# EAGLE design V0.8 (EAGLE 9.1.1)

## Sheet 1 of 2
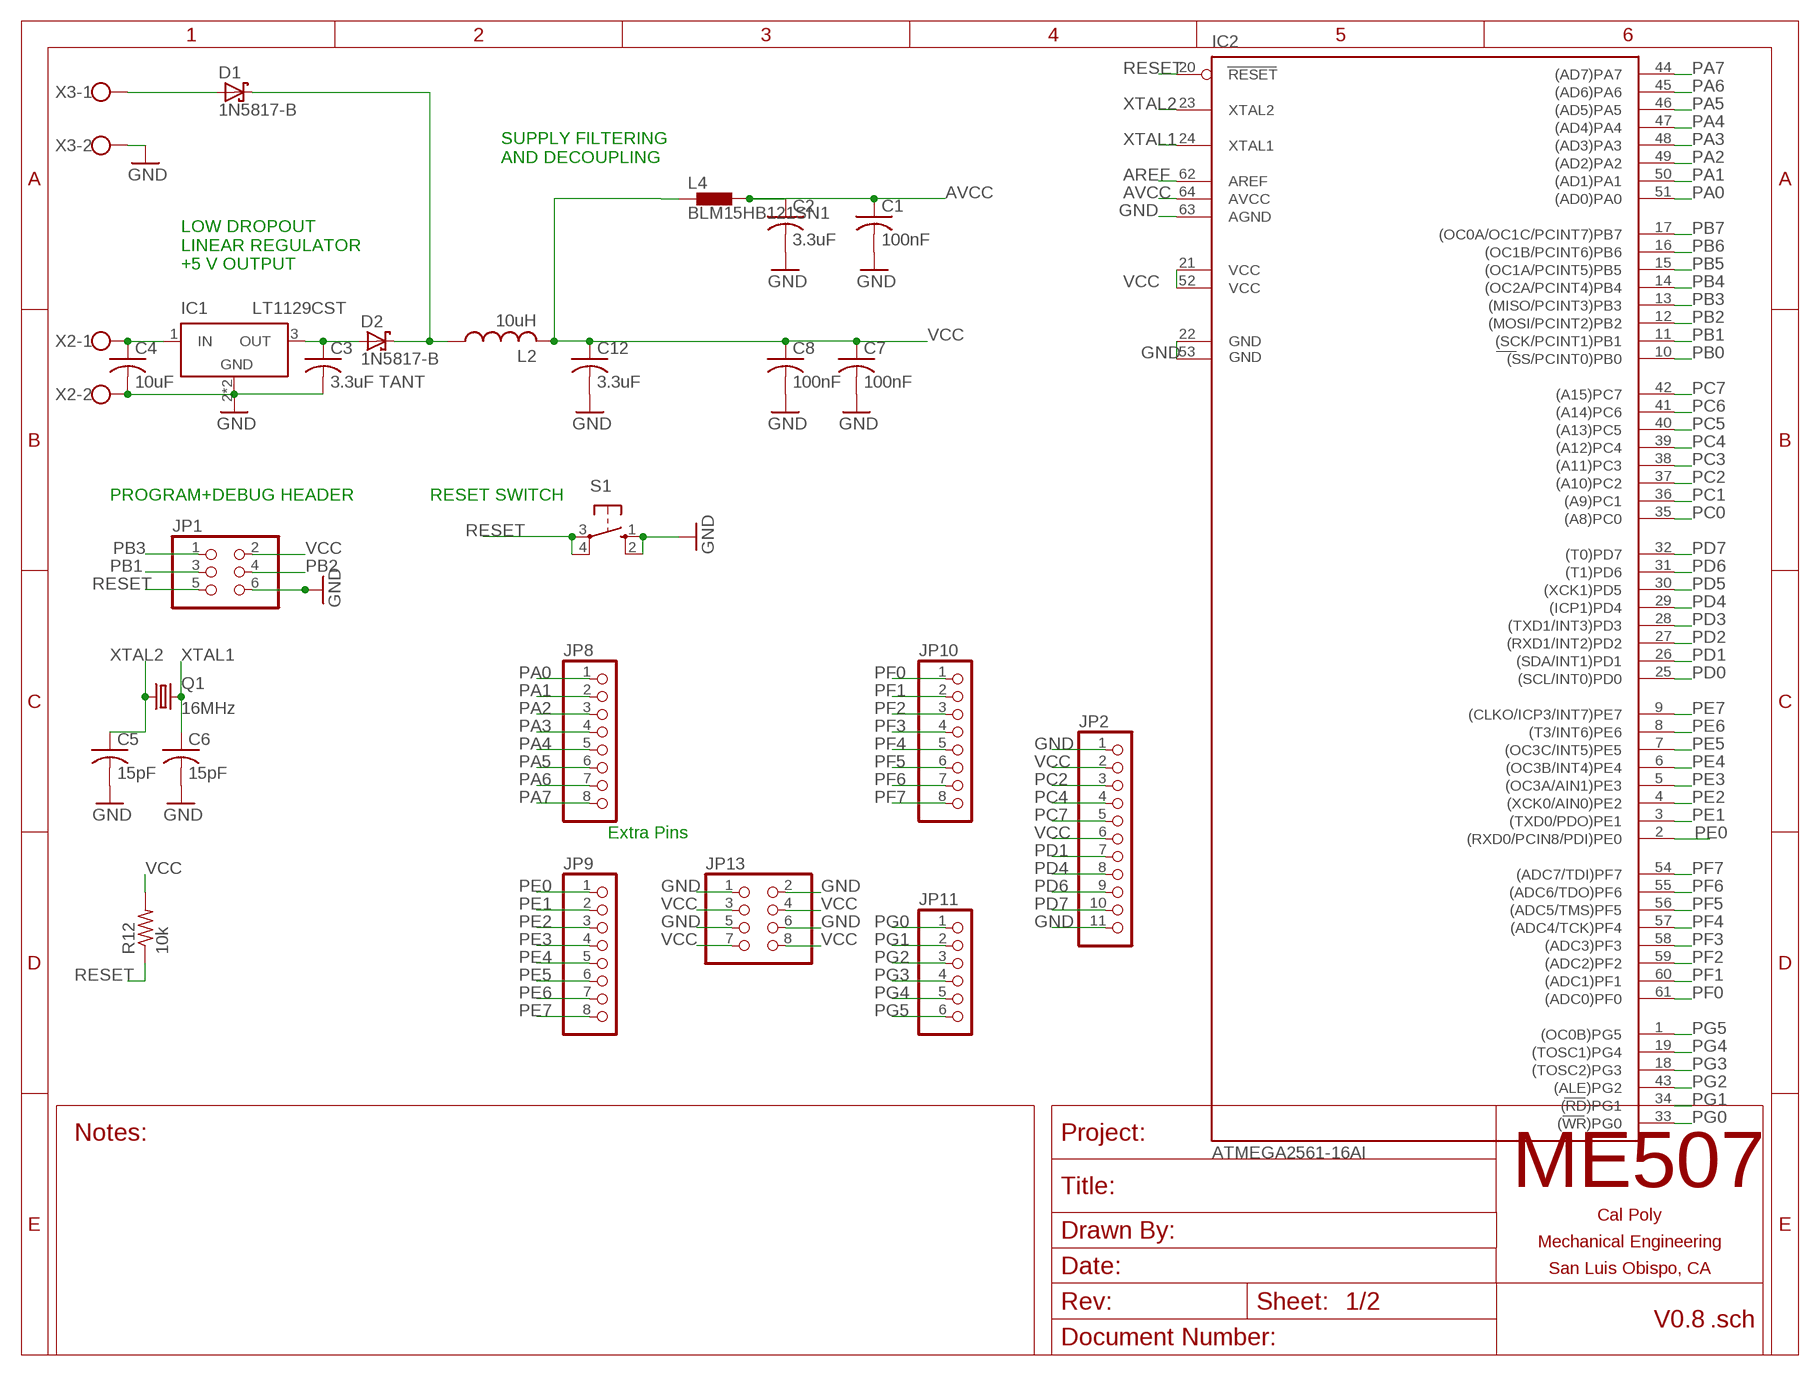
[diagram p0: schematic, sheet 1]

### Parts
C1  100nF  C-USC0805  [C0805]
C2  3.3uF  C-USC0805  [C0805]
C3  3.3uF TANT  C-USC0805  [C0805]
C4  10uF  C-USC0805  [C0805]
C5  15pF  C-USC0805  [C0805]
C6  15pF  C-USC0805  [C0805]
C7  100nF  C-USC0805  [C0805]
C8  100nF  C-USC0805  [C0805]
C12  3.3uF  C-USC0805  [C0805]
D1  1N5817-B  [DO41-7.6]
D2  1N5817-B  [DO41-7.6]
IC1  LT1129CST  [SOT223]
IC2  ATMEGA2561-16AI  [TQFP64]
JP1  PINHD-2X3  [2X03]
JP2  PINHD-1X11  [1X11]
JP8  PINHD-1X8  [1X08]
JP9  PINHD-1X8  [1X08]
JP10  PINHD-1X8  [1X08]
JP11  PINHD-1X6  [1X06]
JP13  PINHD-2X4  [2X04]
L2  10uH  L-USL1812  [L1812]
L4  BLM15HB121SN1  [0402]
Q1  16MHz  CRYSTALHC49S  [HC49/S]
R12  10k  R-US_R0805  [R0805]
S1  10-XX  [B3F-10XX]
X2  W237-102  [W237-102]
X3  W237-102  [W237-102]

### Nets
AREF: IC2.62(AREF)
AVCC: C1.1 C2.1 IC2.64(AVCC) L4.2
GND: C1.2 C2.2 C3.2 C4.2 C5.2 C6.2 C7.2 C8.2 C12.2 IC1.2(GND) IC1.4(GND) IC2.22(GND) IC2.53(GND1) IC2.63(AGND) JP1.6 JP2.1 JP2.11 JP13.1 JP13.2 JP13.5 JP13.6 S1.1(S) S1.2(S1) X2.2 X3.2 ; also sheet 2
N$12: D1.C D2.C L2.1
N$13: D1.A X3.1
PA0: IC2.51((AD0)PA0) JP8.1
PA1: IC2.50((AD1)PA1) JP8.2
PA2: IC2.49((AD2)PA2) JP8.3
PA3: IC2.48((AD3)PA3) JP8.4
PA4: IC2.47((AD4)PA4) JP8.5
PA5: IC2.46((AD5)PA5) JP8.6
PA6: IC2.45((AD6)PA6) JP8.7
PA7: IC2.44((AD7)PA7) JP8.8
PB0: IC2.10((SS/PCINT0)PB0)
PB1: IC2.11((SCK/PCINT1)PB1) JP1.3
PB2: IC2.12((MOSI/PCINT2)PB2) JP1.4
PB3: IC2.13((MISO/PCINT3)PB3) JP1.1
PB4: IC2.14((OC2A/PCINT4)PB4) ; also sheet 2
PB5: IC2.15((OC1A/PCINT5)PB5) ; also sheet 2
PB6: IC2.16((OC1B/PCINT6)PB6) ; also sheet 2
PB7: IC2.17((OC0A/OC1C/PCINT7)PB7) ; also sheet 2
PC0: IC2.35((A8)PC0) ; also sheet 2
PC1: IC2.36((A9)PC1) ; also sheet 2
PC2: IC2.37((A10)PC2) JP2.3 ; also sheet 2
PC3: IC2.38((A11)PC3) ; also sheet 2
PC4: IC2.39((A12)PC4) JP2.4 ; also sheet 2
PC5: IC2.40((A13)PC5) ; also sheet 2
PC6: IC2.41((A14)PC6) ; also sheet 2
PC7: IC2.42((A15)PC7) JP2.5
PD0: IC2.25((SCL/INT0)PD0)
PD1: IC2.26((SDA/INT1)PD1) JP2.7
PD2: IC2.27((RXD1/INT2)PD2) ; also sheet 2
PD3: IC2.28((TXD1/INT3)PD3) ; also sheet 2
PD4: IC2.29((ICP1)PD4) JP2.8
PD5: IC2.30((XCK1)PD5)
PD6: IC2.31((T1)PD6) JP2.9
PD7: IC2.32((T0)PD7) JP2.10
PE0: IC2.2((RXD0/PCIN8/PDI)PE0) JP9.1
PE1: IC2.3((TXD0/PDO)PE1) JP9.2
PE2: IC2.4((XCK0/AIN0)PE2) JP9.3
PE3: IC2.5((OC3A/AIN1)PE3) JP9.4
PE4: IC2.6((OC3B/INT4)PE4) JP9.5
PE5: IC2.7((OC3C/INT5)PE5) JP9.6
PE6: IC2.8((T3/INT6)PE6) JP9.7
PE7: IC2.9((CLKO/ICP3/INT7)PE7) JP9.8
PF0: IC2.61((ADC0)PF0) JP10.1
PF1: IC2.60((ADC1)PF1) JP10.2
PF2: IC2.59((ADC2)PF2) JP10.3
PF3: IC2.58((ADC3)PF3) JP10.4
PF4: IC2.57((ADC4/TCK)PF4) JP10.5
PF5: IC2.56((ADC5/TMS)PF5) JP10.6
PF6: IC2.55((ADC6/TDO)PF6) JP10.7
PF7: IC2.54((ADC7/TDI)PF7) JP10.8
PG0: IC2.33((WR)PG0) JP11.1
PG1: IC2.34((RD)PG1) JP11.2
PG2: IC2.43((ALE)PG2) JP11.3
PG3: IC2.18((TOSC2)PG3) JP11.4
PG4: IC2.19((TOSC1)PG4) JP11.5
PG5: IC2.1((OC0B)PG5) JP11.6
RESET: IC2.20(RESET) JP1.5 R12.1 S1.3(P) S1.4(P1)
VCC: C7.1 C8.1 C12.1 IC2.21(VCC) IC2.52(VCC1) JP1.2 JP2.2 JP2.6 JP13.3 JP13.4 JP13.7 JP13.8 L2.2 L4.1 R12.2 ; also sheet 2
VIN: C4.1 IC1.1(IN) X2.1
VOUT: C3.1 D2.A IC1.3(OUT)
XTAL1: C6.1 IC2.24(XTAL1) Q1.2
XTAL2: C5.1 IC2.23(XTAL2) Q1.1

### Notes on the sheet
- SUPPLY FILTERING 
  AND DECOUPLING
- LOW DROPOUT
  LINEAR REGULATOR
  +5 V OUTPUT
- PROGRAM+DEBUG HEADER | RESET SWITCH
- Extra Pins

## Sheet 2 of 2
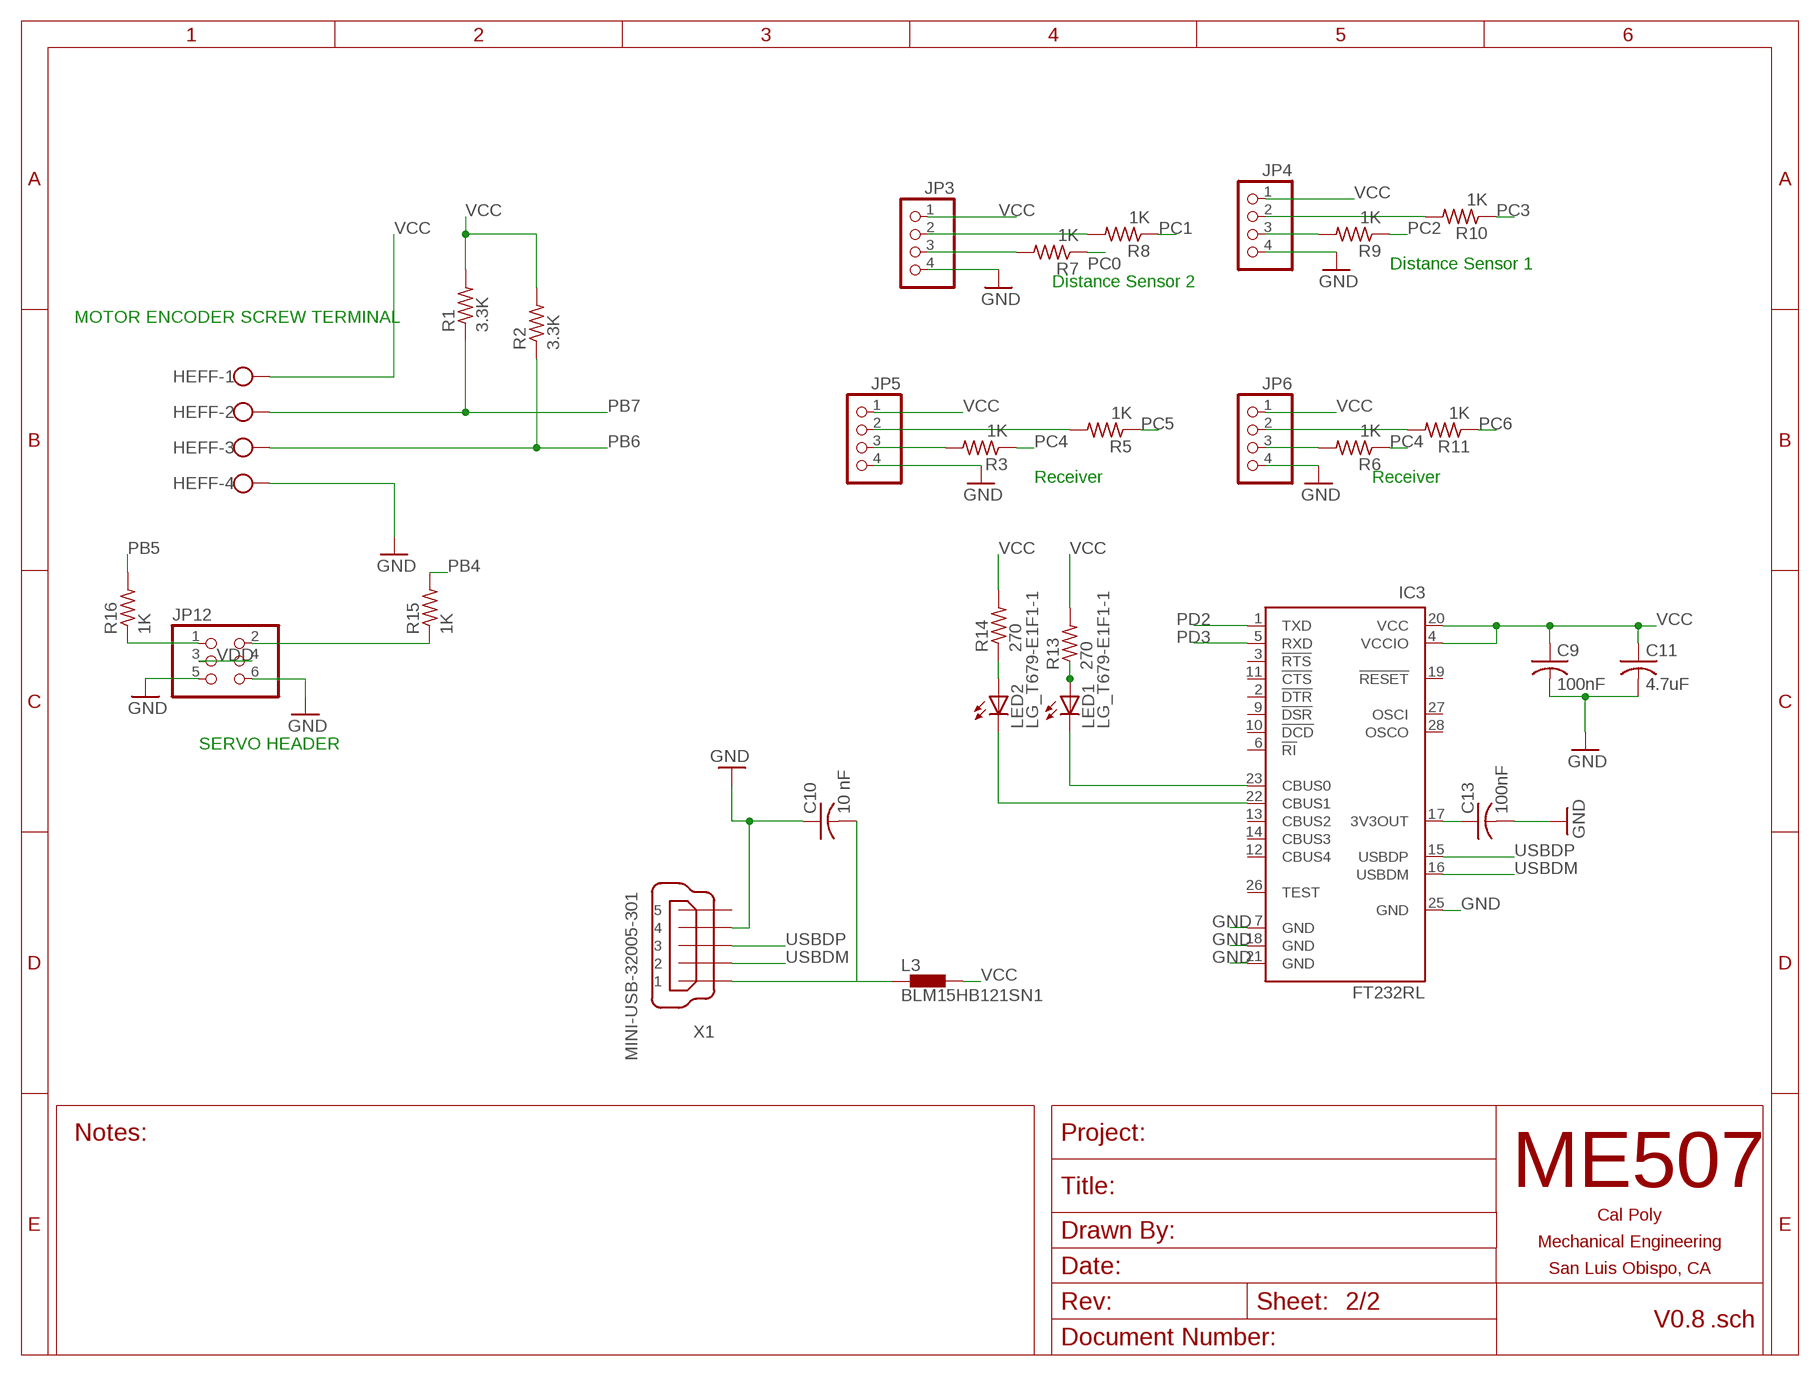
[diagram p1: schematic, sheet 2]

### Parts
C9  100nF  C-USC0805  [C0805]
C10  10 nF  C-USC0805  [C0805]
C11  4.7uF  C-USC0805  [C0805]
C13  100nF  C-USC0805  [C0805]
HEFF  W237-4  [W237-4]
IC3  FT232RL  [SSOP28]
JP3  PINHD-1X4  [1X04]
JP4  PINHD-1X4  [1X04]
JP5  PINHD-1X4  [1X04]
JP6  PINHD-1X4  [1X04]
JP12  PINHD-2X3  [2X03]
L3  BLM15HB121SN1  [0402]
LED1  LG_T679-E1F1-1  [PLCC2]
LED2  LG_T679-E1F1-1  [PLCC2]
R1  3.3K  R-US_R0805  [R0805]
R2  3.3K  R-US_R0805  [R0805]
R3  1K  R-US_R0805  [R0805]
R5  1K  R-US_R0805  [R0805]
R6  1K  R-US_R0805  [R0805]
R7  1K  R-US_R0805  [R0805]
R8  1K  R-US_R0805  [R0805]
R9  1K  R-US_R0805  [R0805]
R10  1K  R-US_R0805  [R0805]
R11  1K  R-US_R0805  [R0805]
R13  270  R-US_R0805  [R0805]
R14  270  R-US_R0805  [R0805]
R15  1K  R-US_R0805  [R0805]
R16  1K  R-US_R0805  [R0805]
X1  MINI-USB-32005-301  [32005-301]

### Nets
GND: C9.2 C10.1 C11.2 C13.2 HEFF.4 IC3.7(GND) IC3.18(GND) IC3.21(GND) IC3.25(GND) JP3.4 JP4.4 JP5.4 JP6.4 JP12.5 JP12.6 X1.4 ; also sheet 1
N$1: JP4.3 R9.2
N$2: JP5.3 R3.2
N$3: JP6.3 R6.2
N$4: JP5.2 R5.2
N$5: JP3.2 R8.2
N$6: JP3.3 R7.2
N$7: JP4.2 R10.2
N$9: JP6.2 R11.2
N$10: C10.2 L3.1 X1.1
N$11: C13.1 IC3.17(3V3OUT)
N$14: IC3.23(CBUS0) LED1.C
N$15: LED1.A R13.1
N$16: JP12.2 R15.1
N$17: IC3.22(CBUS1) LED2.C
N$18: LED2.A R14.1
N$19: JP12.1 R16.1
PB4: R15.2 ; also sheet 1
PB5: R16.2 ; also sheet 1
PB6: HEFF.3 R2.1 ; also sheet 1
PB7: HEFF.2 R1.1 ; also sheet 1
PC0: R7.1 ; also sheet 1
PC1: R8.1 ; also sheet 1
PC2: R9.1 ; also sheet 1
PC3: R10.1 ; also sheet 1
PC4: R3.1 R6.1 ; also sheet 1
PC5: R5.1 ; also sheet 1
PC6: R11.1 ; also sheet 1
PD2: IC3.1(TXD) ; also sheet 1
PD3: IC3.5(RXD) ; also sheet 1
USBDM: IC3.16(USBDM) X1.2
USBDP: IC3.15(USBDP) X1.3
VCC: C9.1 C11.1 HEFF.1 IC3.4(VCCIO) IC3.20(VCC) JP3.1 JP4.1 JP5.1 JP6.1 L3.2 R1.2 R2.2 R13.2 R14.2 ; also sheet 1
VDD: JP12.3 JP12.4
Unconnected: IC3.2(!DTR) IC3.3(!RTS) IC3.6(!RI) IC3.9(!DSR) IC3.10(!DCD) IC3.11(!CTS) IC3.12(CBUS4) IC3.13(CBUS2) IC3.14(CBUS3) IC3.19(!RESET) IC3.26(TEST) IC3.27(OSCI) IC3.28(OSCO) X1.5

### Notes on the sheet
- Distance Sensor 1
- Distance Sensor 2
- MOTOR ENCODER SCREW TERMINAL
- Receiver | Receiver
- SERVO HEADER

## Library data of the parts
C1-C13 = rcl:C-US: CAPACITOR, American symbol; SPICEPREFIX: C
D1 D2 = diode:1N581*: 1.0A SCHOTTKY BARRIER RECTIFIER Source: http://www.diodes.com/datasheets/ds23001.pdf
HEFF = con-wago-500:W237-4: WAGO SCREW CLAMP; OC_FARNELL: unknown; OC_NEWARK: unknown
IC1 = ME507:LT1129CST: VOLTAGE REGULATOR with shutdown; MPN: LT1129CST-5#PBF; OC_FARNELL: 1663375; OC_NEWARK: 57M2069
IC2 = atmel-2005:ATMEGA2561*: MICROCONTROLLER 256 Kbytes FLASH 4 Kbytes EEPROM 8 Kbytes SRAM 54 General Purpose I/O pins 6-channels 16-bit PWM 2 x Serial USARTs 8-channels 10-bit A/D
IC3 = ftdichip:FT232R: Source: http://www.ftdichip.com/Documents/DataSheets/DS_FT232R_v104.pdf; MPN: FT232RL; OC_FARNELL: 1146032; OC_NEWARK: 91K9918
JP1 JP12 = pinhead:PINHD-2X3: PIN HEADER
JP2 = pinhead:PINHD-1X11: PIN HEADER
JP3-JP6 = pinhead:PINHD-1X4: PIN HEADER
JP8-JP10 = pinhead:PINHD-1X8: PIN HEADER
JP11 = pinhead:PINHD-1X6: PIN HEADER
JP13 = pinhead:PINHD-2X4: PIN HEADER
L2 = rcl:L-US: INDUCTOR, American symbol; SPICEPREFIX: L
L3 L4 = inductors:BLM15H: EMIFIL (R) Chip Ferrite Bead for GHz Noise Source: http://www.murata.com/ Ferrite Bead BLM15H.pdf
LED1 LED2 = led:*_T679-?-1: LC TOPLED® Low Current LED Source: http://catalog.osram-os.com .. LG_LS_LY_T679_OBS.pdf; COLOR: green
Q1 = crystal:CRYSTAL: CRYSTAL; OC_FARNELL: 1667008; OC_NEWARK: unknown
R1-R3 R5-R16 = rcl:R-US_: RESISTOR, American symbol; SPICEPREFIX: R
S1 = switch-omron:10-XX: OMRON SWITCH; MPN: B3F-1000; OC_FARNELL: 176432; OC_NEWARK: 36M3542
X1 = con-cypressindustries:MINI-USB-: MINI USB-B Conector Source: www.cypressindustries.com; OC_FARNELL: unknown; OC_NEWARK: unknown
X2 X3 = con-wago-500:W237-102: WAGO SCREW CLAMP; MPN: 237-102; OC_FARNELL: unknown; OC_NEWARK: 70K9898

## Board
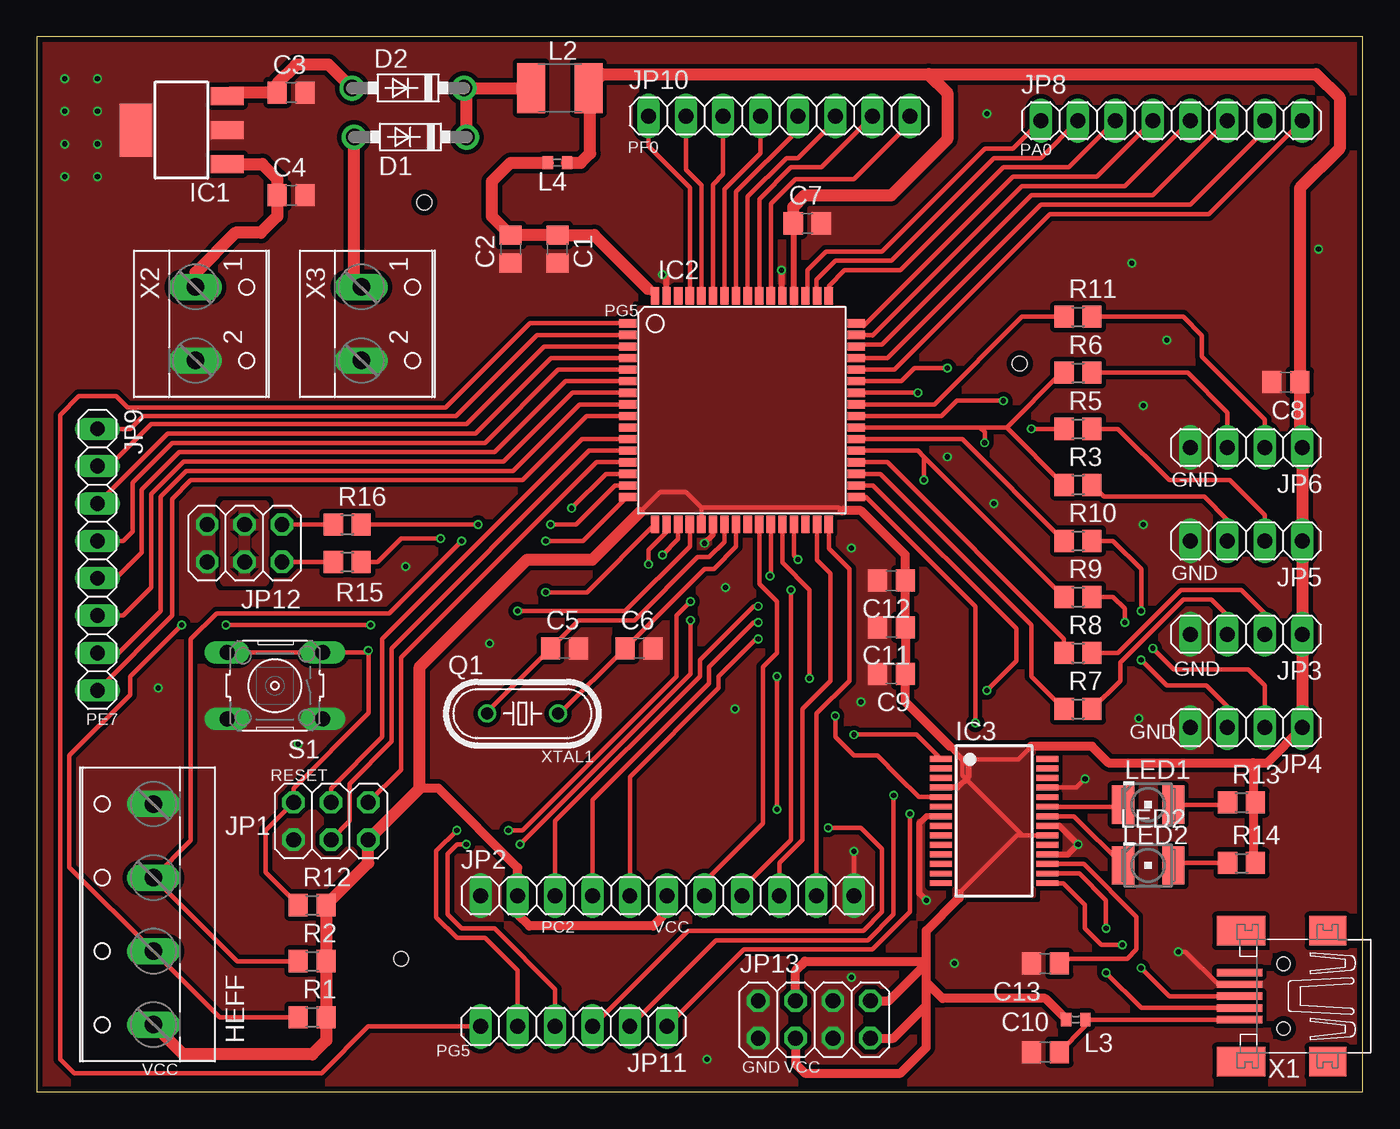
[diagram p2: board, top side]
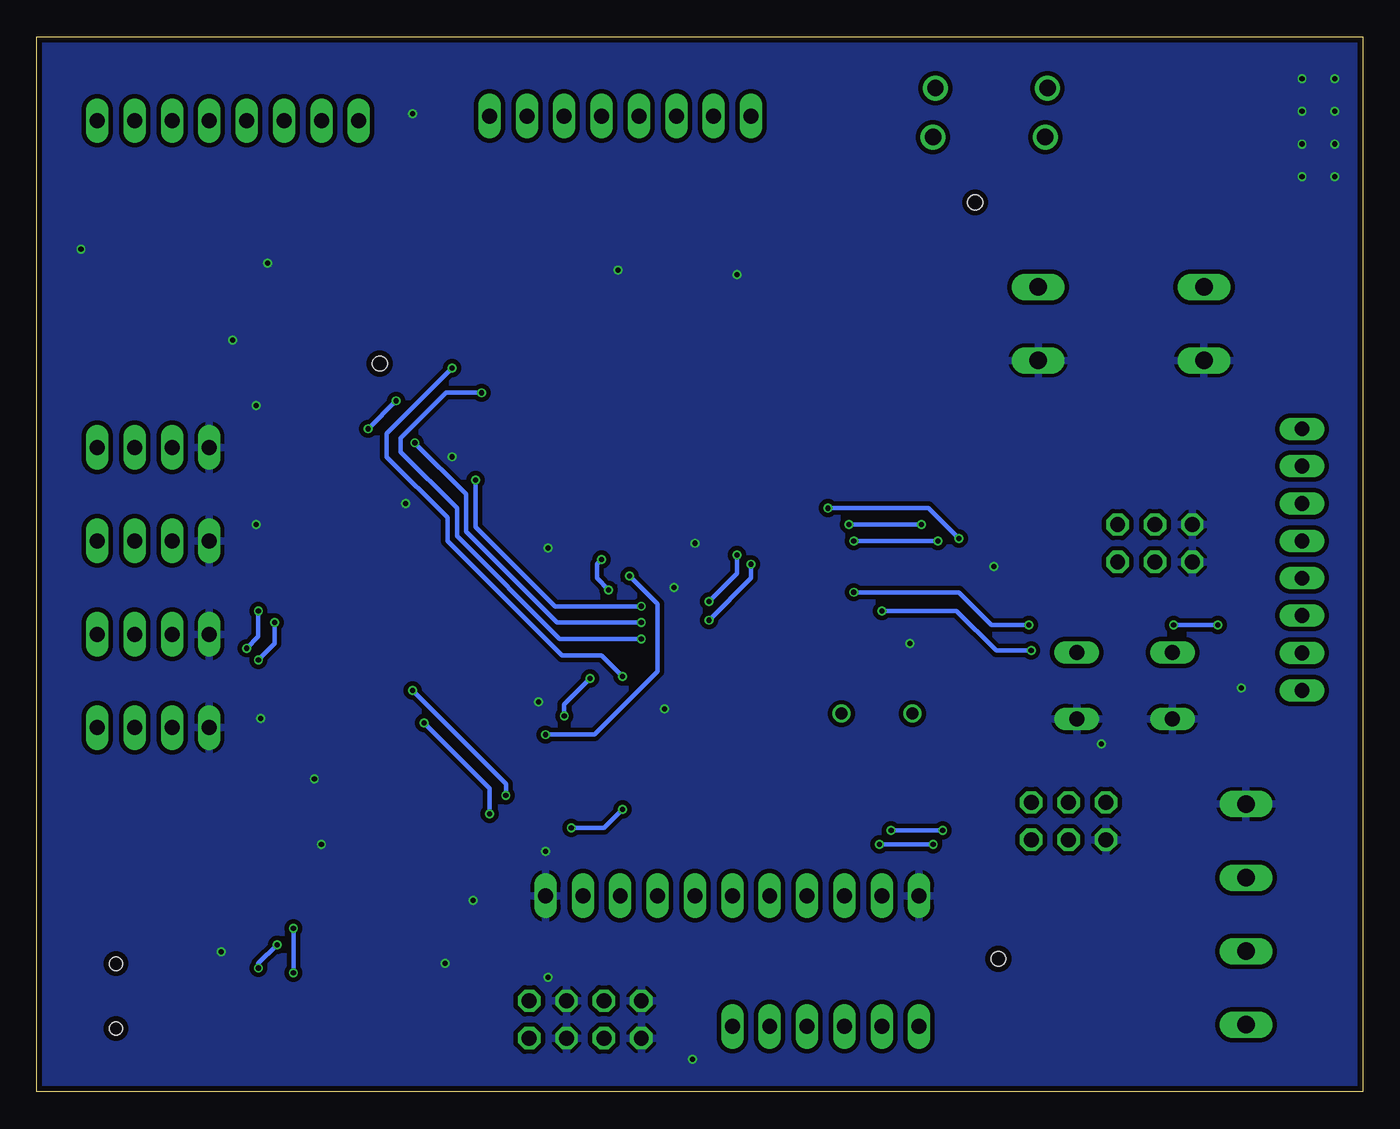
[diagram p3: board, bottom side, seen from below]

Size 90.16 x 71.75 mm. Coordinates in mm from the lower left corner, seen from the top.
Outline: 0,0 90.16,0 90.16,71.75 0,71.75 0,0
Copper layers (1*16): Top 0.035559375mm / dielectric 1.6mm / Bottom 0.035559375mm
Design rules "oshpark-2layer": minimum track width 6mil, minimum drill 10mil, track to track 6mil, track to pad 6mil, pad to pad 6mil, via to via 6mil, smd to smd 6mil, copper to edge 15mil, drill to drill 6mil, minimum pad ring 5mil, minimum via ring 5mil, stop-mask expansion 2.5mil, vias tented up to drill 0mil, thermal gap 10mil
Holes 1 mm at 24.77,9.05 66.83,49.53 26.35,60.48

### Footprints (pad centres in the part's own frame; a part is rotated, then mirrored left to right if it is on the bottom)
C0805 = smd 1.3 x 1.5: 1 -0.95,0; 2 0.95,0
DO41-7.6 = drill 1.1 pad 1.7: A 3.81,0; C -3.81,0
W237-4 = drill 1.194 long: 1 -7.5,-1.27; 2 -2.5,-1.27; 3 2.5,-1.27; 4 7.5,-1.27
SOT223 = smd 1.219 x 2.235: 1 -2.311,-3.099; 2 0,-3.099; 3 2.311,-3.099 | smd 3.6 x 2.2: 4 0,3.099
TQFP64 = smd 1.194 x 0.559: 1 -7.76,5.905; 2 -7.76,5.118; 3 -7.76,4.331; 4 -7.76,3.543; 5 -7.76,2.756; 6 -7.76,1.968; 7 -7.76,1.181; 8 -7.76,0.394; 9 -7.76,-0.394; 10 -7.76,-1.181; 11 -7.76,-1.968; 12 -7.76,-2.756; 13 -7.76,-3.543; 14 -7.76,-4.331; 15 -7.76,-5.118; 16 -7.76,-5.905; 33 7.76,-5.905; 34 7.76,-5.118; 35 7.76,-4.331; 36 7.76,-3.543; 37 7.76,-2.756; 38 7.76,-1.968; 39 7.76,-1.181; 40 7.76,-0.394; 41 7.76,0.394; 42 7.76,1.181; 43 7.76,1.968; 44 7.76,2.756; 45 7.76,3.543; 46 7.76,4.331; 47 7.76,5.118; 48 7.76,5.905 | smd 0.559 x 1.194: 17 -5.905,-7.76; 18 -5.118,-7.76; 19 -4.331,-7.76; 20 -3.543,-7.76; 21 -2.756,-7.76; 22 -1.968,-7.76; 23 -1.181,-7.76; 24 -0.394,-7.76; 25 0.394,-7.76; 26 1.181,-7.76; 27 1.968,-7.76; 28 2.756,-7.76; 29 3.543,-7.76; 30 4.331,-7.76; 31 5.118,-7.76; 32 5.905,-7.76; 49 5.905,7.76; 50 5.118,7.76; 51 4.331,7.76; 52 3.543,7.76; 53 2.756,7.76; 54 1.968,7.76; 55 1.181,7.76; 56 0.394,7.76; 57 -0.394,7.76; 58 -1.181,7.76; 59 -1.968,7.76; 60 -2.756,7.76; 61 -3.543,7.76; 62 -4.331,7.76; 63 -5.118,7.76; 64 -5.905,7.76
SSOP28 = smd 0.4 x 1.5: 1 -4.225,-3.625; 2 -3.575,-3.625; 3 -2.925,-3.625; 4 -2.275,-3.625; 5 -1.625,-3.625; 6 -0.975,-3.625; 7 -0.325,-3.625; 8 0.325,-3.625; 9 0.975,-3.625; 10 1.625,-3.625; 11 2.275,-3.625; 12 2.925,-3.625; 13 3.575,-3.625; 14 4.225,-3.625; 15 4.225,3.625; 16 3.575,3.625; 17 2.925,3.625; 18 2.275,3.625; 19 1.625,3.625; 20 0.975,3.625; 21 0.325,3.625; 22 -0.325,3.625; 23 -0.975,3.625; 24 -1.625,3.625; 25 -2.275,3.625; 26 -2.925,3.625; 27 -3.575,3.625; 28 -4.225,3.625
2X03 = drill 1.016 octagon: 1 -2.54,-1.27; 2 -2.54,1.27; 3 0,-1.27; 4 0,1.27; 5 2.54,-1.27; 6 2.54,1.27
1X11 = drill 1.016 long: 1 -12.7,0; 2 -10.16,0; 3 -7.62,0; 4 -5.08,0; 5 -2.54,0; 6 0,0; 7 2.54,0; 8 5.08,0; 9 7.62,0; 10 10.16,0; 11 12.7,0
1X04 = drill 1.016 long: 1 -3.81,0; 2 -1.27,0; 3 1.27,0; 4 3.81,0
1X08 = drill 1.016 long: 1 -8.89,0; 2 -6.35,0; 3 -3.81,0; 4 -1.27,0; 5 1.27,0; 6 3.81,0; 7 6.35,0; 8 8.89,0
1X06 = drill 1.016 long: 1 -6.35,0; 2 -3.81,0; 3 -1.27,0; 4 1.27,0; 5 3.81,0; 6 6.35,0
2X04 = drill 1.016 octagon: 1 -3.81,-1.27; 2 -3.81,1.27; 3 -1.27,-1.27; 4 -1.27,1.27; 5 1.27,-1.27; 6 1.27,1.27; 7 3.81,-1.27; 8 3.81,1.27
L1812 = smd 1.9 x 3.4: 1 -1.95,0; 2 1.95,0
0402 = smd 0.7 x 0.9: 1 -0.65,0; 2 0.65,0
PLCC2 = smd 2.6 x 1.5: A 0,1.7; C 0,-1.7
HC49/S = drill 0.813: 1 -2.413,0; 2 2.413,0
R0805 = smd 1.3 x 1.5: 1 -0.95,0; 2 0.95,0
B3F-10XX = drill 1.016 long: 1 -3.251,2.261; 2 3.251,2.261; 3 -3.251,-2.261; 4 3.251,-2.261
32005-301 = smd 3.1 x 0.5: 1 3,1.6; 2 3,0.8; 3 3,0; 4 3,-0.8; 5 3,-1.6 | smd 2.5 x 2: M1 -3,-4.45; M2 -3,4.45 | smd 3.3 x 2: M3 2.9,4.45; M4 2.9,-4.45 | hole 0.9: 0,2.2; 0,-2.2
W237-102 = drill 1.194 long: 1 -2.5,-1.27; 2 2.5,-1.27

### Placement (x,y rotation side)
C1  35.4,57.31 270 top
C2  32.23,57.31 270 top
C3  17.3,67.95 0 top
C4  17.3,60.96 0 top
C5  35.88,30.16 0 top
C6  40.96,30.16 0 top
C7  52.39,59.05 0 top
C8  84.93,48.26 180 top
C9  58.1,28.42 180 top
C10  68.58,2.7 0 top
C11  58.1,31.59 180 top
C12  58.1,34.77 180 top
C13  68.58,8.73 180 top
D1  25.4,64.93 180 top
D2  25.24,68.26 180 top
HEFF  6.67,12.06 90 top
IC1  9.84,65.41 90 top
IC2  47.94,46.35 0 top
IC3  65.09,18.41 270 top
JP1  20,18.41 180 top
JP2  42.86,13.33 0 top
JP3  82.23,31.11 180 top
JP4  82.23,24.77 180 top
JP5  82.23,37.46 180 top
JP6  82.23,43.81 180 top
JP8  77.15,66.04 0 top
JP9  4.13,36.2 270 top
JP10  50.48,66.36 0 top
JP11  36.51,4.44 180 top
JP12  14.13,37.31 180 top
JP13  52.86,4.92 0 top
L2  35.56,68.26 0 top
L3  70.64,4.92 180 top
L4  35.4,63.18 180 top
LED1  75.56,19.53 270 top
LED2  75.56,15.4 270 top
Q1  33.02,25.72 0 top
R1  18.73,5.08 0 top
R2  18.73,8.89 0 top
R3  70.8,41.27 0 top
R5  70.8,45.09 0 top
R6  70.8,48.89 0 top
R7  70.8,26.03 0 top
R8  70.8,29.84 0 top
R9  70.8,33.65 0 top
R10  70.8,37.46 0 top
R11  70.8,52.7 0 top
R12  18.73,12.7 0 top
R13  81.92,19.69 0 top
R14  81.92,15.56 0 top
R15  21.11,36.04 0 top
R16  21.11,38.58 0 top
S1  16.19,27.62 180 top
X1  84.77,6.51 180 top
X2  12.06,52.23 270 top
X3  23.34,52.23 270 top

### Tracks (layer width: path | path; a pad name or v marks a point on that pad's centre or on a via)
AVCC
  Top 0.406: IC2.64 41.54,54.61
  Top 0.813: 41.54,54.61 37.89,58.26 C1.1 C2.1 30.96,59.53 30.96,61.91 32.23,63.18 L4.2
GND  (via drill 0.35)
  Top 0.305: JP2.11 v55.56,16.35 | X1.4 80.32,7.31 78.1,9.53 v77.63,9.53 | IC3.25 70.7,20.69 v71.28,21.27
  Top 0.406: v45.4,37.31 45.97,37.88 IC2.22 | v50.64,55.88 50.64,54.17 IC2.53 | IC2.63 42.82,55.28 v42.54,55.56 | IC3.18 70.12,16.14 v70.8,16.83 69.54,18.09 IC3.21 | IC3.7 60.49,18.74 60.01,18.26 60.01,13.49 v60.48,13.02
  other vias: 61.91,43.18 65.09,40 30.8,30.48 25.08,35.72 4.13,68.9 1.91,68.9 1.91,66.68 4.13,66.68 1.91,64.45 4.13,64.45 4.13,62.23 1.91,62.23 46.83,34.29 47.47,26.03 55.4,36.99 76.84,51.12 74.45,56.36 87.15,57.31 8.25,27.46 17.78,23.65 64.61,66.52 62.39,8.73 56.04,26.51 45.56,2.22 55.4,7.78 75.25,46.67 75.25,38.58 74.93,25.4
  pour Top (isolate 0.305, rank 4, no thermals): 0.32,0 0.32,71.76 90.17,71.76 90.17,0.32 0.64,0.32
  pour Bottom (isolate 0.305): 0.16,0 0.16,71.76 89.85,71.76 90.17,71.44 90.17,0.48 90.01,0.32 0.48,0.32
N$1  (via drill 0.35)
  Top 0.305: JP4.3 80.96,26.19 79.53,27.62 76.84,27.62 v75.09,29.37 | v73.98,31.91 73.98,32.86 73.18,33.65 R9.2
  Bottom 0.305: v75.09,29.37 73.98,30.48 v73.98,31.91
N$2
  Top 0.305: JP5.3 80.96,38.89 79.37,40.48 72.55,40.48 R3.2
N$3
  Top 0.305: JP6.3 80.96,46.2 78.26,48.89 R6.2
N$4
  Top 0.305: JP5.2 83.5,39.21 81.12,41.59 76.99,41.59 73.5,45.09 R5.2
N$5
  Top 0.305: JP3.2 83.5,32.54 81.92,34.13 77.79,34.13 73.5,29.84 R8.2
N$6
  Top 0.305: R7.2 73.66,27.94 73.66,29.21 77.95,33.5 79.85,33.5 80.96,32.38 JP3.3
N$7  (via drill 0.35)
  Top 0.305: R10.2 73.18,37.46 75.09,35.56 v75.09,32.7 | v75.88,30.16 77.31,28.73 82.39,28.73 83.5,27.62 JP4.2
  Bottom 0.305: v75.09,32.7 75.09,30.96 v75.88,30.16
N$9
  Top 0.305: JP6.2 83.5,45.72 79.22,50.01 79.22,51.43 77.95,52.7 R11.2
N$10
  Top 0.305: X1.1 71.31,4.91 | 71.31,4.91 L3.1 | C10.2 71.31,4.47 71.31,4.91
N$11
  Top 0.305: IC3.17 71.19,15.49 74.77,11.91 74.77,9.68 74.14,9.05 69.85,9.05
  Top 0.61: 69.85,9.05 C13.1
N$12
  Top 0.813: L2.1 D2.C 29.21,68.1 D1.C
N$13
  Top 0.813: X3.1 21.59,55.2 D1.A
N$14
  Top 0.305: IC3.23 73.73,19.39 LED1.C
N$15
  Top 0.152: 80.81,19.53 R13.1
  Top 0.305: LED1.A 80.81,19.53
N$16
  Top 0.305: JP12.2 R15.1
N$17
  Top 0.305: LED2.C 70.52,18.74 IC3.22
N$18
  Top 0.305: LED2.A 77.42,15.56 R14.1
N$19
  Top 0.305: JP12.1 R16.1
PA0
  Top 0.305: IC2.51 52.39,54.23 52.39,55.88 53.66,57.15 57.47,57.15 64.45,64.14 66.36,64.14 JP8.1
PA1
  Top 0.305: IC2.50 53.02,54.15 53.02,55.23 54.3,56.51 58.1,56.51 65.09,63.5 68.26,63.5 JP8.2
PA2
  Top 0.305: JP8.3 70.17,62.87 65.72,62.87 58.74,55.88 54.93,55.88 53.85,54.8 IC2.49
PA3
  Top 0.305: IC2.48 56.01,52.26 56.2,52.07 66.36,62.23 72.07,62.23 JP8.4
PA4
  Top 0.305: IC2.47 56.79,51.47 56.83,51.43 66.99,61.59 73.98,61.59 JP8.5
PA5
  Top 0.305: IC2.46 55.82,50.8 57.47,50.8 67.63,60.96 75.88,60.96 JP8.6
PA6
  Top 0.305: IC2.45 57.84,49.9 68.26,60.32 78.42,60.32 83.5,65.41 JP8.7
PA7
  Top 0.305: IC2.44 58.32,49.11 68.9,59.69 79.69,59.69 JP8.8
PB1
  Top 0.305: JP1.3 20,20.64 23.49,24.13 23.49,30.8 37.08,44.39 IC2.11
PB2
  Top 0.305: JP1.4 21.27,18.41 21.27,20.95 24.13,23.81 24.13,30.16 37.57,43.6 IC2.12
PB3
  Top 0.305: JP1.1 24.76,21.91 24.76,29.53 25.56,30.32 38.05,42.81 IC2.13
PB4  (via drill 0.35)
  Top 0.305: R15.2 23.18,36.04 24.76,37.62 v27.46,37.62 | IC2.14 38.69,42.02 v36.35,39.69
  Bottom 0.305: v27.46,37.62 29.53,39.69 v36.35,39.69
PB5  (via drill 0.35)
  Top 0.305: IC2.15 39.33,41.24 36.67,38.58 v34.92,38.58 | R16.2 v30,38.58
  Bottom 0.305: v30,38.58 v34.92,38.58
PB6  (via drill 0.35)
  Top 0.305: R2.1 13.61,8.89 HEFF.3 10.48,17.1 10.48,30.8 12.22,32.54 23.97,32.54 v28.89,37.46 | v34.61,37.46 37.15,37.46 40.13,40.45 IC2.16
  Bottom 0.305: v28.89,37.46 v34.61,37.46
PB7  (via drill 0.35)
  Top 0.305: R1.1 12.42,5.08 HEFF.2 2.22,15.28 2.22,22.86 6.35,26.99 6.35,28.26 v9.84,31.75 | IC2.17 37.41,33.97 v34.61,33.97 | v12.86,31.75 v22.7,31.75
  Bottom 0.305: v34.61,33.97 27.46,33.97 25.24,31.75 v22.7,31.75 | v9.84,31.75 v12.86,31.75
PC0
  Top 0.305: R7.1 67.63,28.26 67.63,31.75 57.35,42.02 IC2.35
PC1
  Top 0.305: IC2.36 57.84,42.81 69.85,30.79 R8.1
PC2  (via drill 0.35)
  Top 0.305: IC2.37 59.91,43.6 60.33,43.18 | 60.33,43.18 R9.1 | 60.33,43.18 v60.33,41.59 | JP2.3 35.24,18.1 35.24,18.41 45.09,28.26 45.09,29.37 48.74,33.02 v49.05,33.02
  Bottom 0.305: v60.33,41.59 60.33,38.42 54.93,33.02 v49.05,33.02
PC3
  Top 0.305: IC2.38 62.93,44.39 R10.1
PC4  (via drill 0.35)
  Top 0.305: IC2.39 64.14,45.17 | 64.14,45.17 65.95,45.17 | 65.95,45.17 R3.1 | 65.95,45.17 69.67,48.89 R6.1 | 64.14,45.17 64.45,44.86 v64.45,44.13 | v49.05,31.91 48.74,31.91 45.72,28.89 45.72,27.78 37.78,19.84 JP2.4
  Bottom 0.305: v64.45,44.13 60.96,40.64 60.96,38.1 54.77,31.91 v49.05,31.91
PC5  (via drill 0.35)
  Top 0.305: IC2.40 61.52,45.96 62.55,46.99 v65.72,46.99 | v67.63,45.09 R5.1
  Bottom 0.305: v65.72,46.99 v67.63,45.09
PC6
  Top 0.305: IC2.41 61.04,46.75 66.99,52.7 R11.1
PC7  (via drill 0.35)
  Top 0.305: IC2.42 v59.92,47.54 | v49.05,30.8 48.89,30.8 46.35,28.26 46.35,27.46 40.32,21.43 JP2.5
  Bottom 0.305: v59.92,47.54 62.32,47.54 65.4,44.45 65.4,43.5 61.6,39.69 61.6,37.78 54.61,30.8 v49.05,30.8
PD1
  Top 0.305: JP2.7 45.4,14.29 49.37,18.26 49.37,28.89 50.32,29.84 50.32,33.34 49.12,34.54 49.12,36.44 49.12,36.67 IC2.26
PD2  (via drill 0.35)
  Top 0.305: IC2.27 49.91,35.15 v49.85,35.08 | IC3.1 59.81,24.29 v55.56,24.29
  Bottom 0.305: v49.85,35.08 47.94,33.18 47.94,28.57 52.23,24.29 v55.56,24.29
PD3  (via drill 0.35)
  Top 0.305: IC2.28 50.7,35.98 52.55,34.13 v52.55,28.1 | IC3.5 59.97,20.04 58.58,21.43 57.15,22.86 55.56,22.86 54.29,24.13 v54.29,25.56
  Bottom 0.305: v54.29,25.56 54.29,26.35 v52.55,28.1
PD4  (via drill 0.35)
  Top 0.305: JP2.8 47.94,13.81 51.28,17.14 v51.28,34.13 | IC2.29 51.49,36.46 v51.75,36.2
  Bottom 0.305: v51.75,36.2 52.07,35.88 52.07,34.92 v51.28,34.13
PD6
  Top 0.305: IC2.31 53.06,36.16 53.97,35.24 53.97,27.94 52.07,26.03 52.07,17.14 50.48,15.56 JP2.9
PD7
  Top 0.305: IC2.32 53.85,36.96 55.24,35.56 55.24,27.94 53.02,25.72 JP2.10
PE0
  Top 0.305: IC2.2 34.01,51.47 28.5,45.96 7.22,45.96 6.35,45.09 JP9.1
PE1
  Top 0.305: JP9.2 4.92,42.54 7.78,45.4 29.21,45.4 34.49,50.69 IC2.3
PE2
  Top 0.305: JP9.3 8.89,44.77 29.85,44.77 34.98,49.9 IC2.4
PE3
  Top 0.305: IC2.5 35.46,49.11 30.48,44.13 9.21,44.13 6.51,41.43 6.51,38.1 5.87,37.46 JP9.4
PE4
  Top 0.305: IC2.6 35.94,48.32 31.12,43.5 9.68,43.5 7.14,40.96 7.14,36.67 5.4,34.92 JP9.5
PE5
  Top 0.305: IC2.7 36.42,47.54 31.75,42.86 10,42.86 7.78,40.64 7.78,34.29 5.87,32.38 JP9.6
PE6
  Top 0.305: IC2.8 36.91,46.75 32.39,42.23 10.16,42.23 8.41,40.48 8.41,32.7 5.56,29.84 JP9.7
PE7
  Top 0.305: IC2.9 37.39,45.96 33.02,41.59 10.48,41.59 9.21,40.32 9.21,32.38 JP9.8
PF0
  Top 0.305: IC2.61 44.4,61.49 41.59,64.29 JP10.1
PF1
  Top 0.305: IC2.60 45.19,61.65 44.13,62.71 JP10.2
PF2
  Top 0.305: IC2.59 45.97,61.69 46.67,62.39 JP10.3
PF3
  Top 0.305: IC2.58 46.76,61.37 49.21,63.82 JP10.4
PF4
  Top 0.305: IC2.57 47.55,61.2 51.75,65.41 JP10.5
PF5
  Top 0.305: IC2.56 48.34,60.88 50.96,63.5 51.75,63.5 54.29,66.04 JP10.6
PF6
  Top 0.305: IC2.55 49.12,60.71 51.28,62.87 53.34,62.87 JP10.7
PF7
  Top 0.305: IC2.54 49.91,60.39 51.59,62.07 55.56,62.07 59.37,65.88 JP10.8
PG0  (via drill 0.35)
  Top 0.305: IC2.33 56.39,40.45 63.82,33.02 v63.82,25.08 | v59.37,18.89 59.37,14.13 59.37,12.22 57.78,10.64 56.83,9.68 48.1,9.68 JP11.1
  Bottom 0.305: v59.37,18.89 59.37,20.64 61.36,22.62 v63.82,25.08
PG1  (via drill 0.35)
  Top 0.305: IC2.34 56.87,41.24 66.6,31.51 66.6,29.29 v64.61,27.3 | JP11.2 46.2,10.32 56.52,10.32 58.26,12.06 58.26,14.45 v58.26,20.16
  Bottom 0.305: v58.26,20.16 58.26,20.95 v64.61,27.3
PG2  (via drill 0.35)
  Top 0.305: IC2.43 58.8,48.32 59.69,49.21 v61.91,49.21 | JP11.3 44.29,10.95 56.2,10.95 57.47,12.22 57.47,16.51 56.04,17.94 v53.82,17.94 | v50.32,28.26 v50.32,19.21
  Bottom 0.305: v61.91,49.21 66.36,44.77 66.36,43.18 62.23,39.05 62.23,37.46 54.45,29.69 51.75,29.69 v50.32,28.26 | v50.32,19.21 51.59,17.94 v53.82,17.94
PG3  (via drill 0.35)
  Top 0.305: JP11.4 35.24,6.98 31.12,11.11 28.89,11.11 27.94,12.06 27.94,16.19 28.57,16.83 v29.21,16.83 | IC2.18 42.82,38.06 41.59,36.83 v41.59,35.88 | v32.86,16.83 44.45,28.42 v44.45,32.07
  Bottom 0.305: v41.59,35.88 41.59,34.92 v44.45,32.07 | v29.21,16.83 v32.86,16.83
PG4  (via drill 0.35)
  Top 0.305: v44.45,33.34 43.5,32.38 43.5,28.26 33.02,17.78 v32.07,17.78 | v28.56,17.78 27.17,16.38 27.17,11.88 28.56,10.48 30.48,10.48 32.7,8.26 JP11.5 | IC2.19 43.61,37.58 v42.54,36.51
  Bottom 0.305: v42.54,36.51 42.54,35.24 v44.45,33.34 | v28.56,17.78 v32.07,17.78
PG5
  Top 0.305: JP11.6 22.54,4.44 19.37,1.27 2.54,1.27 1.59,2.22 1.59,46.04 2.86,47.31 5.4,47.31 6.19,46.51 27.78,46.51 33.53,52.26 IC2.1
RESET  (via drill 0.35)
  Top 0.305: R12.1 15.56,14.92 15.56,17.78 JP1.5 17.46,20.64 22.58,25.76 22.58,29.97 v22.54,30 22.42,29.88 S1.3 S1.4 | IC2.20 44.4,37.1 40,32.7 v32.7,32.7
  Bottom 0.305: v32.7,32.7 27.62,32.7 24.92,30 v22.54,30
USBDM  (via drill 0.35)
  Top 0.305: IC3.16 70.89,14.84 72.71,13.02 72.71,12.22 v72.71,11.11 | v72.71,8.1 75.09,5.71 77.63,5.71 X1.2
  Bottom 0.305: v72.71,11.11 v72.71,8.1
USBDP  (via drill 0.35)
  Top 0.305: X1.3 77.47,6.51 76.99,6.51 76.2,7.3 v75.09,8.41 | v73.82,10 72.39,10 71.28,11.11 71.28,12.7 69.79,14.19 IC3.15
  Bottom 0.305: v75.09,8.41 75.09,8.73 v73.82,10
VCC
  Top 0.305: IC2.21 45.19,39.74 | 45.19,39.74 44.13,40.8 42.39,40.8 40.96,39.37 | IC3.20 67.31,17.44 | 67.31,17.44 67.01,17.44 62.94,21.51 62.94,22.62 66.75,22.62 67.63,23.49 | 62.71,13.49 66.65,17.44 67.31,17.44 | 54.77,39.53 54.55,39.74 45.19,39.74
  Top 0.406: 62.07,23.49 62.94,22.62 63.34,22.23 63.34,21.43 62.6,20.69 IC3.4 | C7.1 51.44,54.16 IC2.52
  Top 0.61: 82.71,22.38 72.87,22.38 71.76,23.49 67.63,23.49 | L3.2 68.56,6.35 61.6,6.35 60.48,7.46 60.48,7.94 | 60.48,7.94 60.48,8.73 | 60.48,8.73 60.48,9.05 | 60.48,9.05 60.48,10.95 62.71,13.18 62.71,13.49 | 82.71,22.38 82.71,19.84 | 82.71,19.84 R13.2 | 82.71,19.84 82.71,15.71 R14.2 | 62.07,23.49 59.05,26.51 C9.1 C11.1 C12.1 59.05,36.52 56.04,39.53 54.77,39.53 | JP13.4 51.59,8.26 52.23,8.89 60.32,8.89 60.48,9.05 | JP13.3 51.59,1.9 52.23,1.27 58.74,1.27 60.48,3.02 60.48,5.87 | JP13.8 57.94,6.19 60.48,8.73 | 60.48,5.87 60.48,7.94 | JP13.7 58.26,3.65 60.48,5.87 | 26.03,20.64 27.3,20.64 32.7,15.24 JP2.2 32.7,12.06 33.5,11.27 41.91,11.27 42.86,12.22 JP2.6 | 82.71,22.38 83.66,22.38 JP4.1
  Top 0.813: 60.64,69.22 61.91,67.95 61.91,64.77 58.1,60.96 52.23,60.96 51.44,60.17 C7.1 | 60.64,69.22 86.99,69.22 88.58,67.63 88.58,64.14 85.88,61.44 C8.1 85.88,43.98 JP6.1 JP5.1 JP3.1 JP4.1 | HEFF.1 9.96,2.54 18.73,2.54 19.68,3.49 R1.2 R2.2 R12.2 22.54,15.56 JP1.2 26.03,20.64 26.03,28.89 33.34,36.2 37.78,36.2 40.96,39.37 | 60.64,69.22 38.46,69.22 L2.2 37.62,68.15 37.62,63.82 36.99,63.18 L4.1
  pour Top: 40.96,39.37 40.96,53.34 54.93,53.34 54.93,39.37
  pour Top: 62.39,13.33 62.39,23.49 67.79,23.49 67.79,13.33
VDD
  pour Top: 12.86,34.77 12.86,39.85 15.4,39.85 15.4,34.77
VIN
  Top 0.813: IC1.1 15.33,63.09 16.35,62.07 C4.1 16.35,59.53 15.24,58.42 13.49,58.42 10.8,55.72 X2.1
VOUT
  Top 0.813: IC1.3 13.17,67.95 C3.1 16.35,68.58 17.62,69.85 19.84,69.85 D2.A
XTAL1
  Top 0.305: Q1.2 35.56,25.72 C6.1 45.4,35.56 46.04,35.56 47.55,37.07 IC2.24
XTAL2
  Top 0.305: Q1.1 30.61,25.84 C5.1 36.83,32.07 40.64,32.07 44.93,36.35 45.72,36.35 46.76,37.39 IC2.23

### Text on the board
tPlace: PF0 | PA0 | PG5 | GND | GND | GND | PE7 | GND | XTAL1 | RESET | PC2 | VCC | PG5 | GND | VCC | VCC